# EAGLE design PLA_Sticks_Gen2_Rev4 (EAGLE 7.7.0)
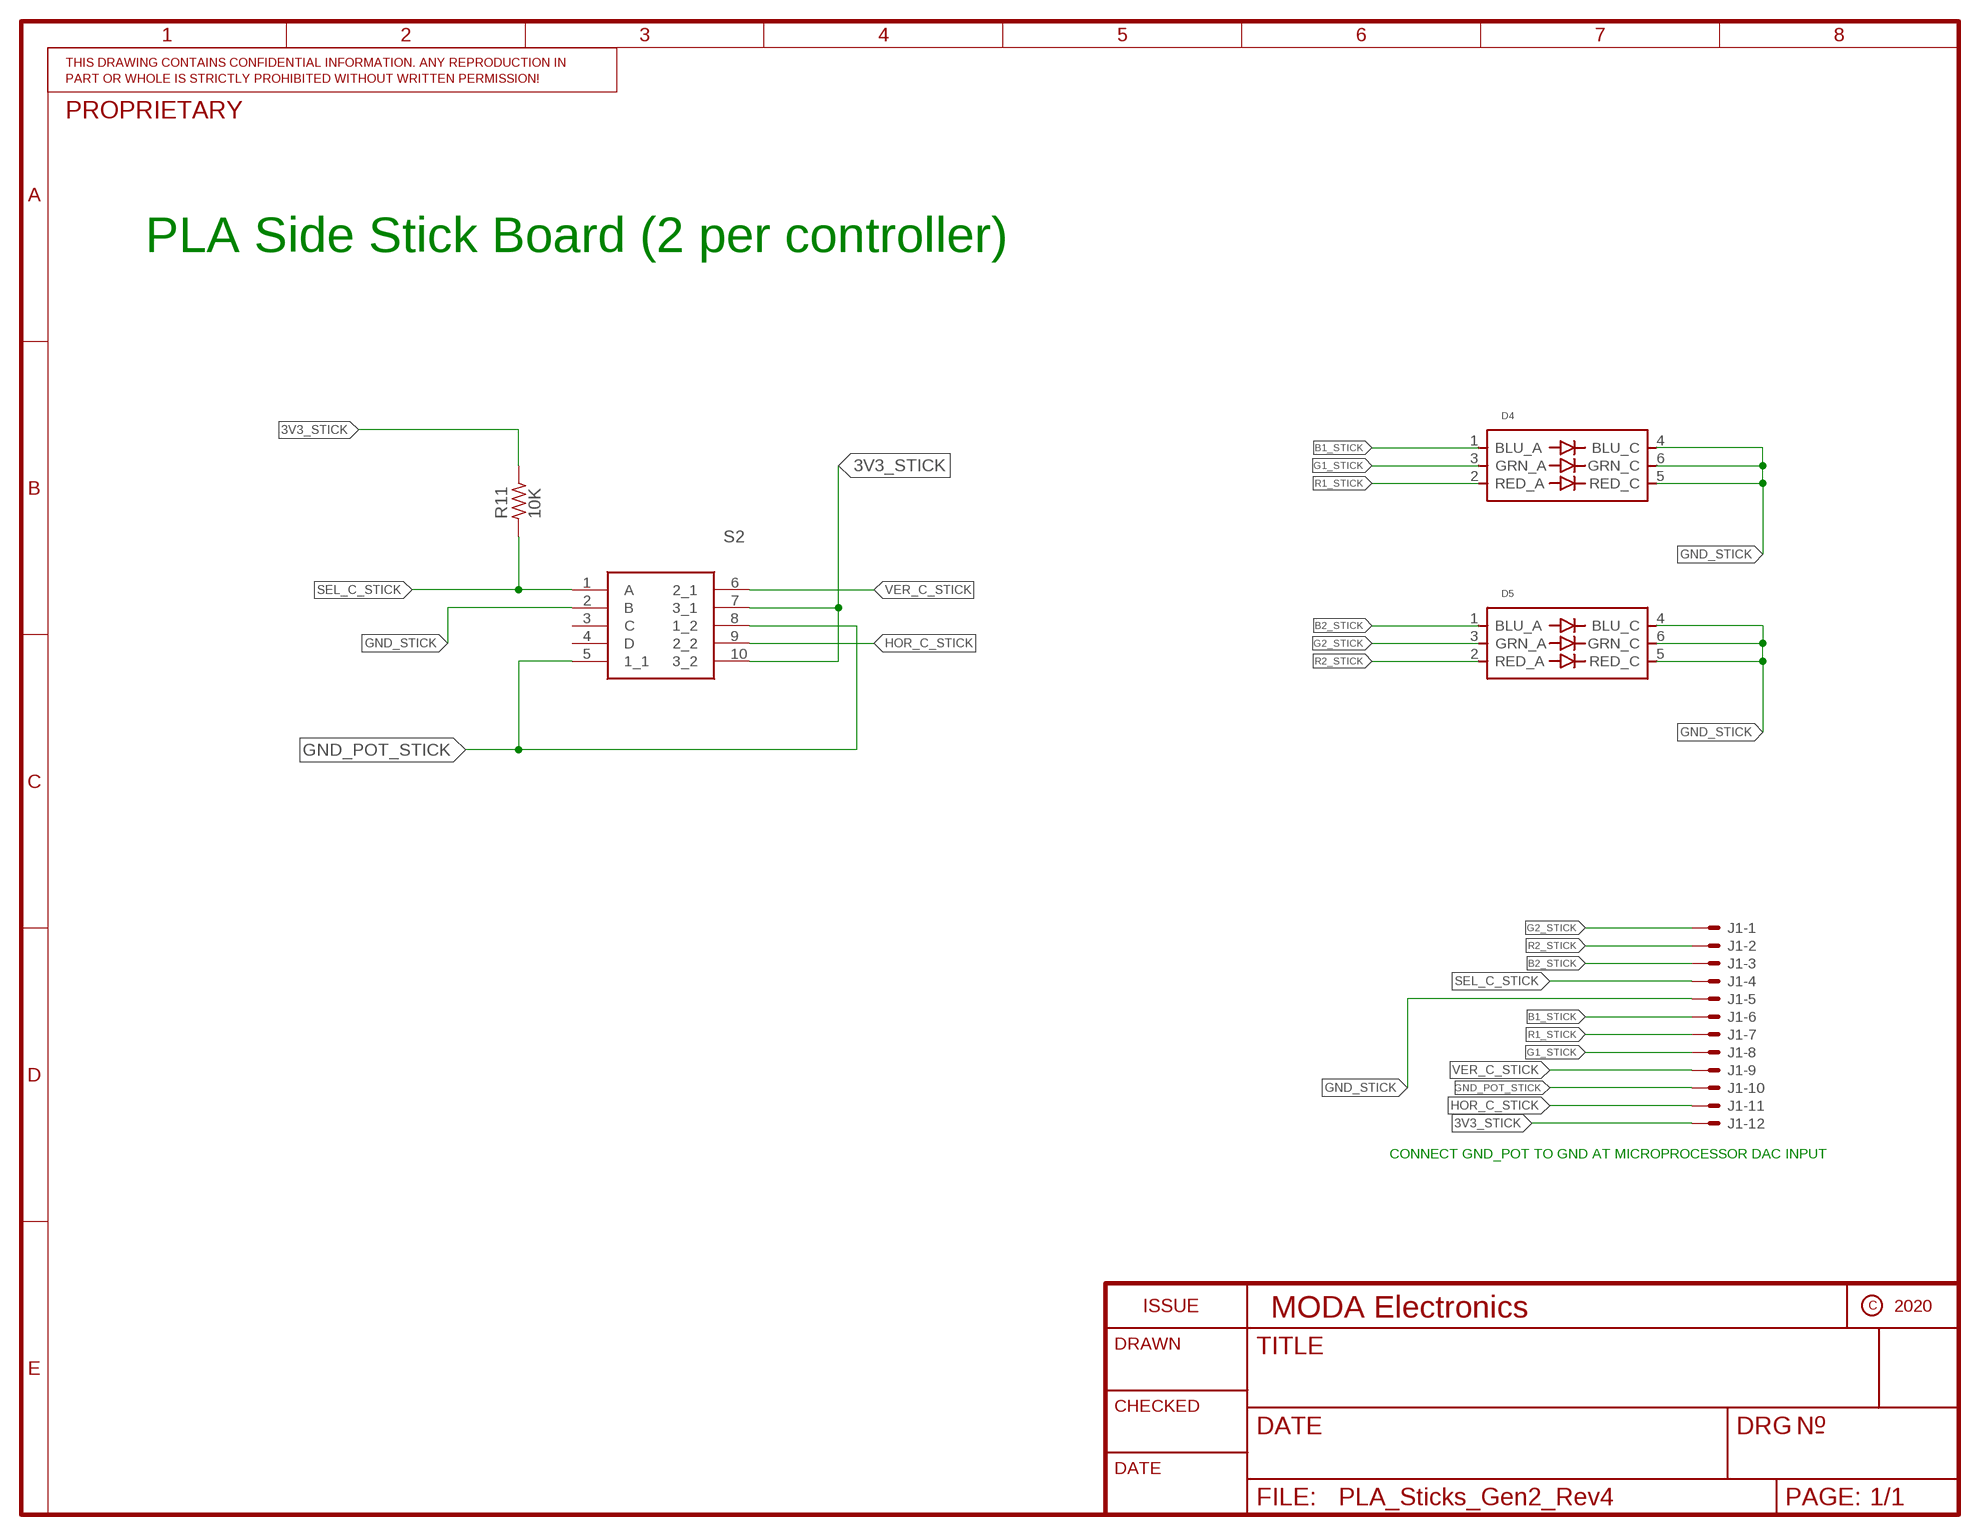
[diagram p0: schematic, sheet 1]

## Parts
D4  XZFBBM2ACRDG92W-3  [XZFBBM2ACRDG92W-3]
D5  XZFBBM2ACRDG92W-3  [XZFBBM2ACRDG92W-3]
J1  SM12B-SSR-H-TB  [SM12B-SSR-H-TB]
R11  10K  R_0603  [R0603]
S2  RKJXV1224005  [RKJXV1224005]

## Nets
3V3_STICK: J1.12 R11.2 S2.7(3_1) S2.10(3_2)
B1_STICK: D4.1(BLU_A) J1.6
B2_STICK: D5.1(BLU_A) J1.3
G1_STICK: D4.3(GRN_A) J1.8
G2_STICK: D5.3(GRN_A) J1.1
GND_POT_STICK [vcc]: J1.10 S2.5(1_1) S2.8(1_2)
GND_STICK [vcc]: D4.4(BLU_C) D4.5(RED_C) D4.6(GRN_C) D5.4(BLU_C) D5.5(RED_C) D5.6(GRN_C) J1.5 S2.2(B)
HOR_C_STICK: J1.11 S2.9(2_2)
R1_STICK: D4.2(RED_A) J1.7
R2_STICK: D5.2(RED_A) J1.2
SEL_C_STICK: J1.4 R11.1 S2.1(A)
VER_C_STICK: J1.9 S2.6(2_1)
Unconnected: S2.3(C) S2.4(D)

## Notes on the sheet
- PLA Side Stick Board (2 per controller)
- CONNECT GND_POT TO GND AT MICROPROCESSOR DAC INPUT

## Library data of the parts
D4 D5 = XZFBBM2ACRDG92W-3:XZFBBM2ACRDG92W-3: Red, Green, Blue (RGB) 625nm Red, 525nm Green, 470nm Blue LED Indication - Discrete 2.2V Red, 3.2V Green, 3.3V Blue 6-SMD, No Lead ( https://www.digikey.com/product-detail/en/sunled/XZFBBM2ACRDG92W-3/1497-1226-1-ND/5001279 ); PARTNO: XZFBBM2ACRDG92W-3
J1 = con-jst:SM12B-SSR-H-TB: Disconnectable Insulation displacement connector, 1.0mm pitch 12 contacts; PARTNO: BM12B-SRSS-TB(LF)(SN)
R11 = rc-master-smd:R_: RESISTOR; PARTNO: ERJ-2GEJ103X
S2 = RKJXV1224005:RKJXV1224005: Multi-Directional Switches Stick Controller Source: Datasheet <http://www.alps.com/prod/info/E/HTML/MultiControl/Potentiometer/RKJXK/RKJXV1224005.html>; DESCRIPTION: Multi-Directional Switches Stick Controller; HEIGHT: mm; MANUFACTURER_NAME: ALPS; MANUFACTURER_PART_NUMBER: RKJXV1224005; MOUSER_PART_NUMBER: 688-RKJXV1224005; MOUSER_PRICE-STOCK: https://www.mouser.com/Search/Refine.aspx?Keyword=688-RKJXV1224005; PARTNO: RKJXV1224005; RS_PART_NUMBER: 1239578; RS_PRICE-STOCK: http://uk.rs-online.com/web/p/products/1239578

## Net classes
0 default: width 0.203 mm, drill 0.305 mm, clearance 0.178 mm
1 vcc: width 0.203 mm, drill 0.305 mm, clearance 0.178 mm
3 diff90: width 0.406 mm, drill 0.356 mm, clearance 0.254 mm

## Board
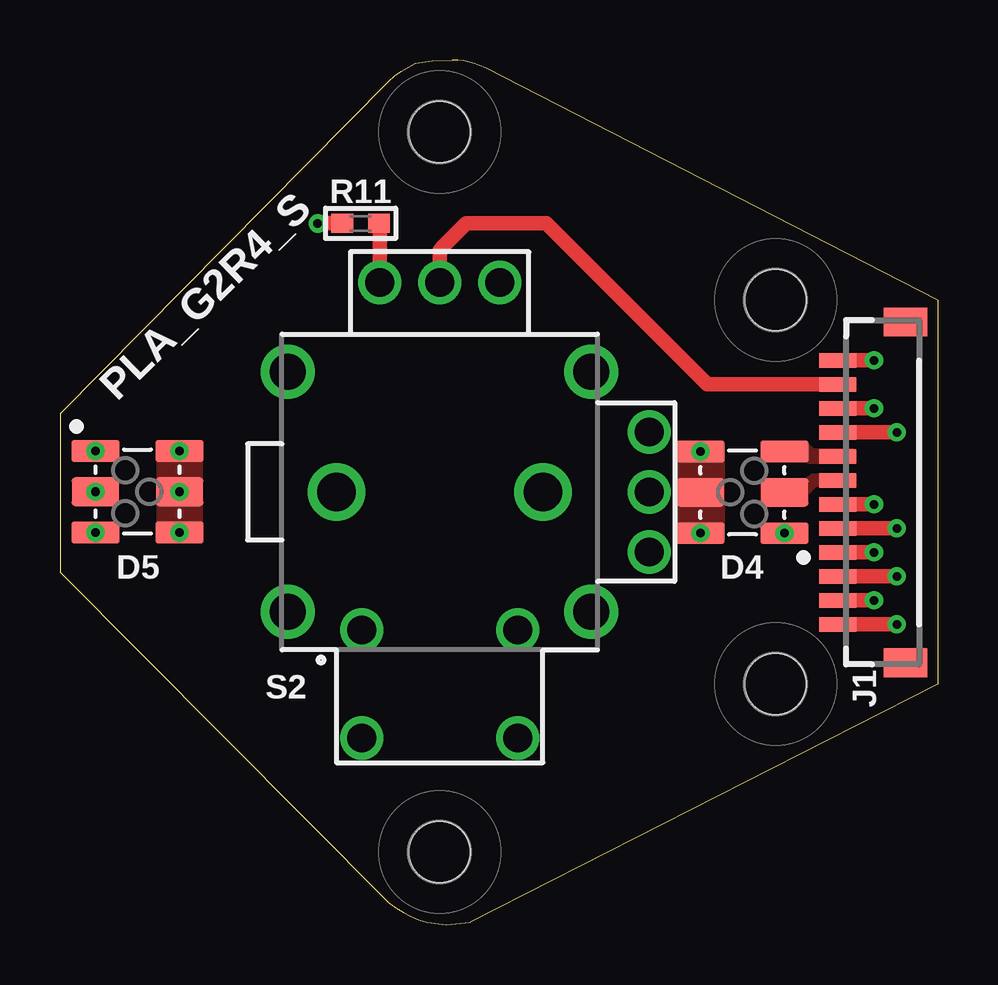
[diagram p1: board, top side]
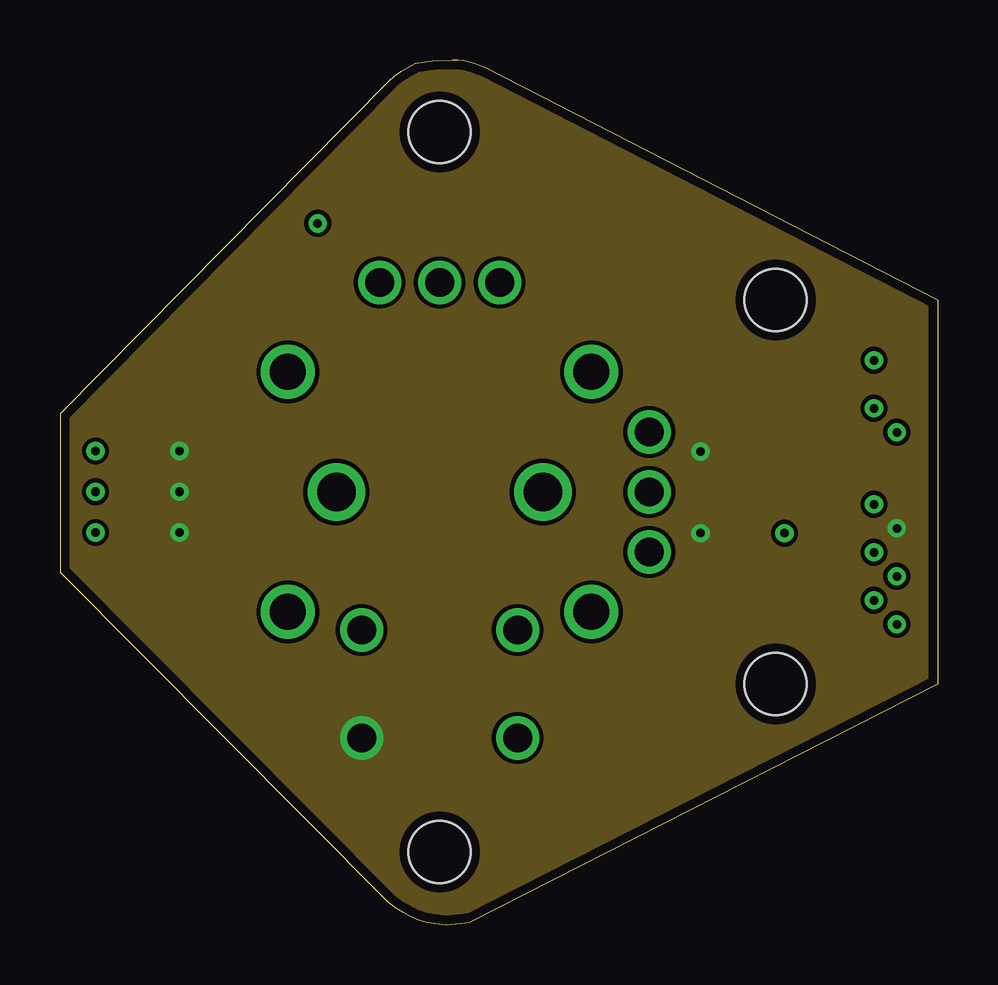
[diagram p2: board, inner layer GND]
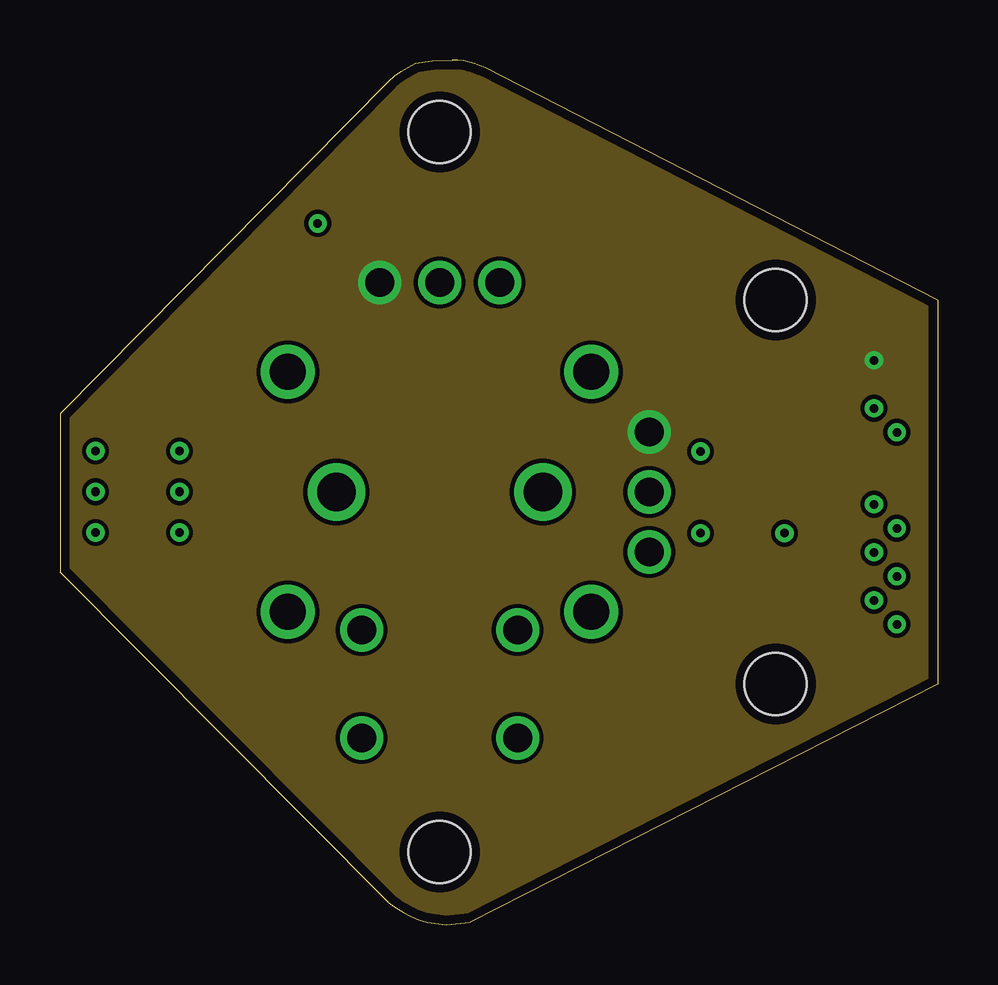
[diagram p3: board, inner layer Route15]
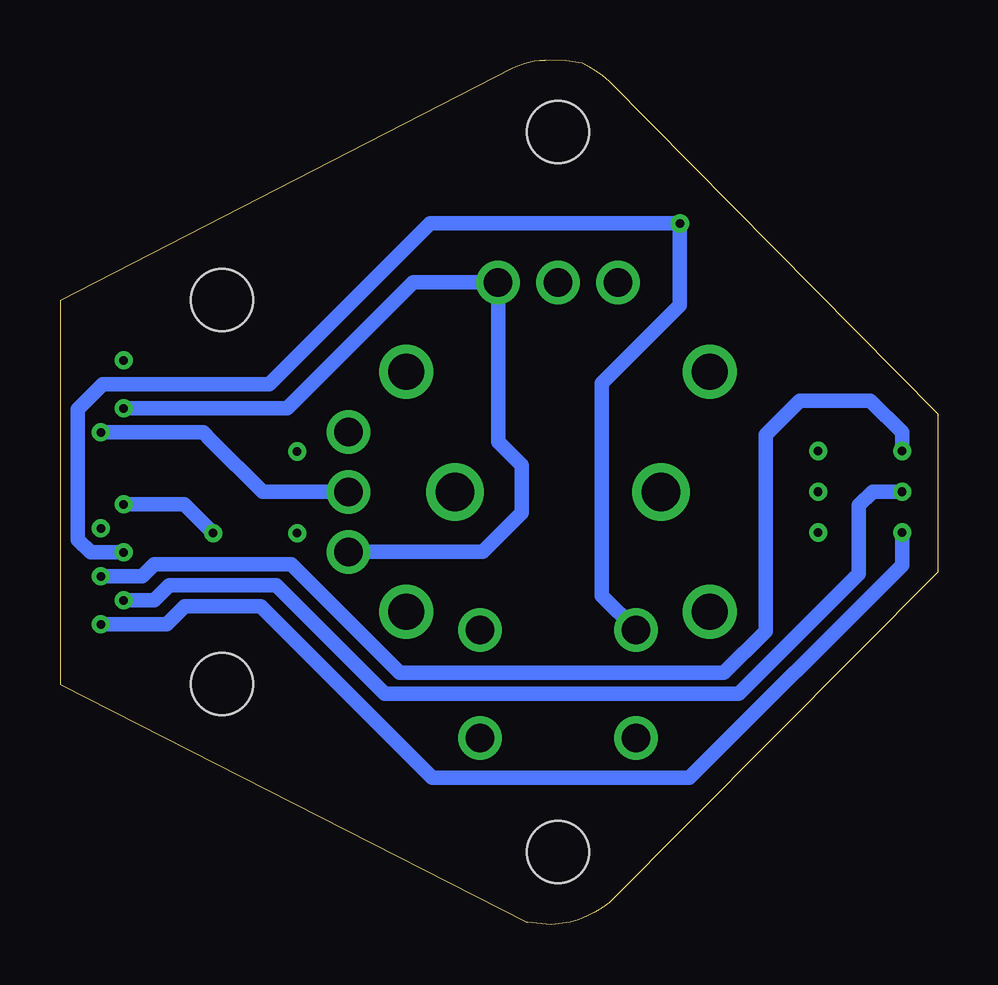
[diagram p4: board, bottom side, seen from below]

Size 36.57 x 36.03 mm. Coordinates in mm from the lower left corner, seen from the top.
Outline: 36.57,10.03 17.1,0.1 16.1,0 15.3,0.1 arc-22 13.69,0.91 0,14.7 0,21.3 13.69,35.16 arc-15 14.8,35.9 15.5,36 16.34,36.03 arc-27 17.71,35.7 36.57,26.03 36.57,10.03
Copper layers (1+2*15+16): Top 0.035mm / dielectric 0.3mm / GND 0.035mm / dielectric 0.85mm / Route15 0.035mm / dielectric 0.3mm / Bottom 0.035mm
Design rules "SSC-EAGLE-4Lyr_v1.0.0.3 *": minimum track width 7mil, minimum drill 12mil, track to track 7mil, track to pad 7mil, pad to pad 7mil, via to via 8mil, smd to smd 0mil, copper to edge 15mil, drill to drill 16mil, minimum pad ring 8mil, minimum via ring 8mil, stop-mask expansion 3mil, vias tented up to drill 14mil, thermal gap 10mil
tRestrict: area -134.5,-87.2 to -133.7,-87.1

### Footprints (pad centres in the part's own frame; a part is rotated, then mirrored left to right if it is on the bottom)
XZFBBM2ACRDG92W-3 = smd 2 x 0.9: 1 -1.75,1.7; 3 -1.75,-1.7; 4 1.75,1.7; 6 1.75,-1.7 | smd 2 x 1.2: 2 -1.75,0; 5 1.75,0
SM12B-SSR-H-TB = smd 0.6 x 1.55: 1 -5.5,1.925; 2 -4.5,1.925; 3 -3.5,1.925; 4 -2.5,1.925; 5 -1.5,1.925; 6 -0.5,1.925; 7 0.5,1.925; 8 1.5,1.925; 9 2.5,1.925; 10 3.5,1.925; 11 4.5,1.925; 12 5.5,1.925 | smd 1.2 x 1.8: FIT@1 -7.1,-0.9; FIT@2 7.1,-0.9
R0603 = smd 0.9 x 0.8: 1 -0.762,0; 2 0.762,0
RKJXV1224005 = drill 1.2 pad 1.8: 1 -3.25,-5.75; 2 -3.25,-10.25; 3 3.25,-5.75; 4 3.25,-10.25; 5 8.73,-2.5; 6 8.73,0; 7 8.73,2.5; 8 2.5,8.73; 9 0,8.73; 10 -2.5,8.73 | drill 1.5 pad 2.25: 11 -6.325,5; 12 6.325,5; 15 -6.325,-5; 16 6.325,-5 | drill 1.6 pad 2.4: 13 -4.3,0; 14 4.3,0
101-NS = hole 2.578: 0,0

### Placement (x,y rotation side)
D4  28.43,18.02 180 top
D5  3.23,18.05 0 top
J1  34.33,18.02 90 top
R11  12.52,29.23 0 top
S2  15.82,18.03 0 top
U$3  [FAB_FRAME_ANSI-A]  -152.18,-110.41 0 top  (outside the outline)
U$4  [FAB_DOCFIELD_GENERIC]  2.59,-110.18 0 top  (outside the outline)
U$6  [101-NS]  29.82,10.03 270 top
U$7  [101-NS]  15.82,3.03 270 top
U$8  [101-NS]  29.82,26.03 270 top
U$9  [101-NS]  15.82,33.03 270 top

### Tracks (layer width: path | path; a pad name or v marks a point on that pad's centre or on a via)
3V3_STICK  (via drill 0.36)
  Top 0.61: J1.12 v33.91,23.52 | R11.2 13.32,29.19 S2.10
  pour Route15 (rank 2, no thermals): 37.09,26.37 17.01,36.61 14.31,36.61 -0.69,21.45 -0.69,14.7 14.39,-0.46 16.85,-0.54 37.09,9.7
B1_STICK  (via drill 0.36)
  Top 0.61: J1.6 v33.91,17.52
  Bottom 0.61: D4.1 31.39,17.52 v33.91,17.52
  other vias: 30.18,16.32
B2_STICK  (via drill 0.36)
  Top 0.61: J1.3 v34.87,14.52
  Bottom 0.61: v34.87,14.52 33.14,14.52 32.64,15.02 26.93,15.02 22.41,10.49 20.98,10.49 15.5,10.49 8.91,10.49 7.17,12.24 7.17,20.42 5.74,21.84 2.8,21.84 1.48,20.52 D5.1
  other vias: 1.48,19.75
G1_STICK
  pour Top (no thermals): 33.04,19.7 31.38,19.7 31.06,20.02 29.31,20.02 29.31,19.39 31.14,19.39 31.22,19.35 33.04,19.35
G2_STICK  (via drill 0.36)
  Top 0.61: J1.1 v34.87,12.52
  Bottom 0.61: v34.87,12.52 32.13,12.52 31.38,13.27 28.2,13.27 21.06,6.13 20.34,6.13 15.1,6.13 10.34,6.13 1.48,14.99 D5.3
  other vias: 1.48,16.35
GND_POT_STICK  (via drill 0.36)
  Top 0.61: J1.10 v33.91,21.52
  Bottom 0.61: v33.91,21.52 27.97,21.52 27.09,21.52 27.01,21.61 21.85,26.76 S2.8 18.32,20.14 17.33,19.15 17.33,17.16 18.95,15.53 S2.5
GND_STICK  (via drill 0.36)
  Top 0.61: J1.5 v34.87,16.52
  other vias: 26.68,16.32 26.68,19.72 4.98,16.35 4.98,18.05 4.98,19.75
  pour GND (rank 2, no thermals): 36.77,26.13 36.77,9.94 16.85,-0.22 14.55,-0.14 -0.3,14.7 -0.3,21.37 14.47,36.13 17.01,36.21
  pour Top (rank 2, no thermals): 27.56,16.05 25.82,16.05 25.82,20.02 27.56,20.02
  pour Top (rank 2, no thermals): 5.82,16.05 4.15,16.05 4.15,20.02 5.82,20.02
HOR_C_STICK
  Top 0.61: J1.11 26.97,22.52 20.26,29.23 16.93,29.23 15.98,28.27 15.82,28.12 S2.9
R1_STICK
  pour Top (no thermals): 33.04,18.35 31.45,18.35 31.06,17.95 31.06,17.56 29.31,17.56 29.31,18.51 31.14,18.51 31.38,18.69 33.04,18.69
R2_STICK  (via drill 0.36)
  Top 0.61: J1.2 v33.91,13.52
  Bottom 0.61: v33.91,13.52 32.63,13.52 32.01,14.15 27.56,14.15 23.04,9.62 20.82,9.62 15.66,9.62 8.28,9.62 3.28,14.62 3.28,17.48 2.71,18.05 D5.2
  other vias: 1.48,18.05
SEL_C_STICK  (via drill 0.36)
  Top 0.61: R11.1 v10.74,29.23 | v33.91,15.52 J1.4
  Bottom 0.61: v33.91,15.52 35.29,15.52 35.82,16.05 35.82,16.69 35.82,21.49 34.79,22.52 27.84,22.52 21.14,29.23 15.98,29.23 v10.74,29.23 10.74,25.81 13.99,22.56 13.99,13.71 S2.1
VER_C_STICK  (via drill 0.36)
  Top 0.61: J1.9 v34.87,20.52
  Bottom 0.61: S2.6 28.12,18.03 30.26,20.18 30.61,20.52 v34.87,20.52

### Text on the board
tNames: PLA_G2R4_S
Document: PLA CONTROLLER SIDE STICK BOARD (2 PER) | FILES | Board stackup (mm) / / Layer 1 0.035 foil thickness / Bonding ply 0.3 Dielectric Constant 4.5 (+/- 0.10) / Layer 2 0.035 foil thickness / Laminate Core 0.85 Dielectric Constant 4.5 (+/- 0.10) / Layer 3 0.035 foil thickness / Bonding ply 0.3 Dielectric Constant 4.5 (+/- 0.10) / Layer 4 0.035 foil thickness / / Total Thickness 1.59 | NOTES: | 1. PRINTED CIRCUIT BOARD MADE FROM NEMA GRADE FR-4 EPOXY LAMINATE | WITH 1 OUNCE COPPER PLATING AND .063 THICKNESS. | DRL =DRILL TOOL SIZE INFORMATION (INCHES) / DRD =JOB DRILL DATA (NC DRILL LOCATION INFO) / OLN =OUTLINE / L1 =TOP LAYER (POS LAYER) / SLK=SILKSCREEN TOP / BSK=SILKSCREEN BOT / SMT=SOLDER MASK TOP / SMB=SOLDER MASK BOT / L2 =INNER LAYER 1 / L3 =INNER LAYER 2 / L4 =BOT LAYER / TPS=TOP STENCIL / BPS=BOTTOM STENCIL / MNT=PLACE FILE TOP / MNB=PLACE FILE BOTTOM / BOM= BILL OF MATERIALS / SCHEMATIC / FABDRAWING | 2. ALL DIMENSIONS ARE GIVEN IN INCHES. | 3. CIRCUIT PATHS ARE FOR REFERENCE ONLY. | 4. HOLE SIZES SHOWN ARE FINISHED DIAMETERS AFTER PLATING. | 5. BOARD PLATED USING REFLOW OR SIMILAR METHOD. | 6. APPLY GREEN SOLDER MASK ON PLATED SURFACES USING WET FILM SR100 | OR SR1010 EPOXY. EQUIVALENT WET OR DRY FILM MAY BE USED. | 7. SILKSCREEN TOP and BOTTOM SIDE USING WHITE INK. | 8. THE FOLLOWING INFORMATION APPLIES TO THIS BOARD: | A) 4 COPPER LAYERS | B) 0.063 BOARD THICKNESS | C) REQUIRES TOP AND BOTTOM SILKSCREEN